# Altium schematic sheet JY02_2019.SchDoc
size A4
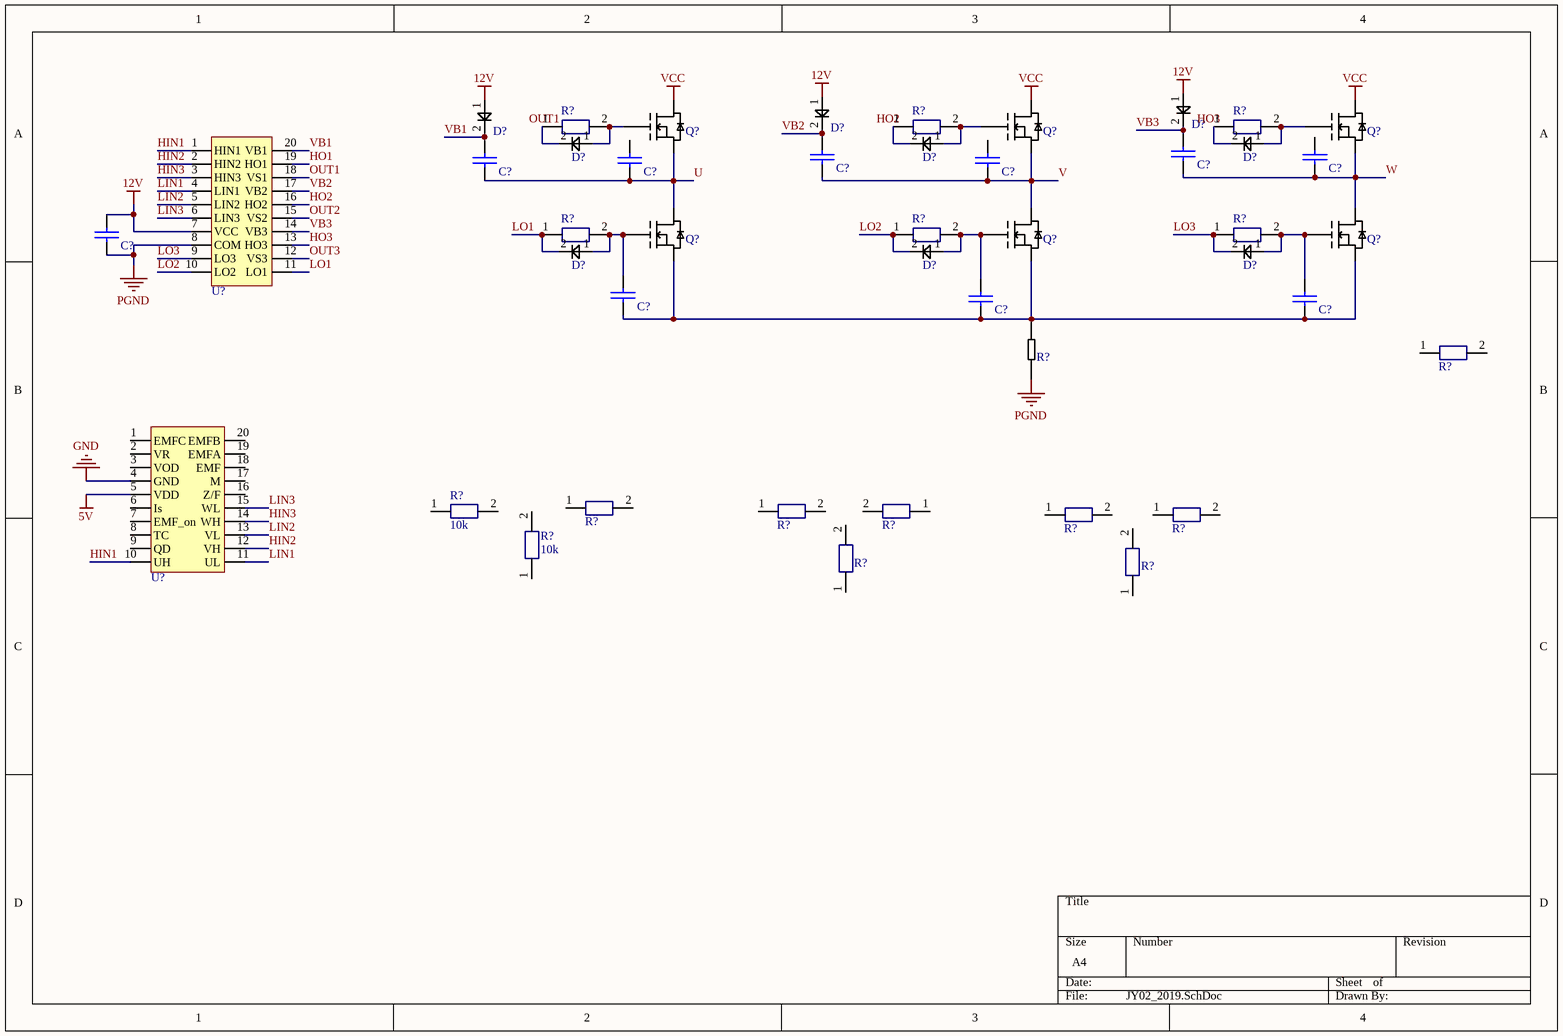
[diagram p0: JY02_2019.SchDoc]

## Parts
(Parts that share a designator on the sheet are numbered #1, #2 ... from top to bottom, then left to right.)
C?#1  0805c  [0805C]  (value not drawn)
C?#2  0805c  [0805C]  (value not drawn)
C?#3  0805c  [0805C]  (value not drawn)
C?#4  0805c  [0805C]  (value not drawn)
C?#5  0805c  [0805C]  (value not drawn)
C?#6  0805c  [0805C]  (value not drawn)
C?#7  0805c  [0805C]  (value not drawn)
C?#8  0805c  [0805C]  (value not drawn)
C?#9  0805c  [0805C]  (value not drawn)
C?#10  0805c  [0805C]  (value not drawn)
D?#1  0805D  [0805D]  (value not drawn)
D?#2  0805D  [0805D]  (value not drawn)
D?#3  0805D  [0805D]  (value not drawn)
D?#4  0805D  [0805D]  (value not drawn)
D?#5  0805D  [0805D]  (value not drawn)
D?#6  0805D  [0805D]  (value not drawn)
D?#7  0805D  [0805D]  (value not drawn)
D?#8  0805D  [0805D]  (value not drawn)
D?#9  0805D  [0805D]  (value not drawn)
Q?#1  NMOS  [TO263-2]  (value not drawn)
Q?#2  NMOS  [TO263-2]  (value not drawn)
Q?#3  NMOS  [TO263-2]  (value not drawn)
Q?#4  NMOS  [TO263-2]  (value not drawn)
Q?#5  NMOS  [TO263-2]  (value not drawn)
Q?#6  NMOS  [TO263-2]  (value not drawn)
R?#1  0805r  [0805R]  (value not drawn)
R?#2  0805r  [0805R]  (value not drawn)
R?#3  0805r  [0805R]  (value not drawn)
R?#4  0805r  [0805R]  (value not drawn)
R?#5  0805r  [0805R]  (value not drawn)
R?#6  0805r  [0805R]  (value not drawn)
R?#7  2512R  [2512R]  (value not drawn)
R?#8  0805r  [0805R]  (value not drawn)
R?#9  0805r  [0805R]  (value not drawn)
R?#10  0805r  [0805R]  (value not drawn)
R?#11  0805r  [0805R]  (value not drawn)
R?#12  0805r  [0805R]  (value not drawn)
R?#13  0805r  [0805R]  (value not drawn)
R?#14  0805r  [0805R]  (value not drawn)
R?#15  0805r  [0805R]  (value not drawn)
R?#16  0805r  [0805R]  (value not drawn)
R?#17  0805r  [0805R]  (value not drawn)
U?#1  FD6288  [TSSOP20-OR65-4R40]  (value not drawn)
U?#2  JY02  [SSOP20-25-150-1]  (value not drawn)

## Nets
5V: U?#2.5(VDD)
12V: C?#7.1 D?#1.1 D?#2.1 D?#3.1 U?#1.7(VCC)
GND: U?#2.4(GND)
PGND: C?#7.2 R?#7.1 U?#1.8(COM)
VCC: Q?#1.2(D) Q?#2.2(D) Q?#3.2(D)
HIN1: U?#1.1(HIN1) U?#2.10(UH)
HIN2: U?#1.2(HIN2) U?#2.12(VH)
HIN3: U?#1.3(HIN3) U?#2.14(WH)
HO1: U?#1.19(HO1)
HO2: U?#1.16(HO2)
HO3: U?#1.13(HO3)
LIN1: U?#1.4(LIN1) U?#2.11(UL)
LIN2: U?#1.5(LIN2) U?#2.13(VL)
LIN3: U?#1.6(LIN3) U?#2.15(WL)
LO1: D?#7.2 R?#4.1 U?#1.11(LO1)
LO2: D?#8.2 R?#5.1 U?#1.10(LO2)
LO3: D?#9.2 R?#6.1 U?#1.9(LO3)
OUT1: U?#1.18(VS1)
OUT2: U?#1.15(VS2)
OUT3: U?#1.12(VS3)
U: C?#2.2 C?#3.2 Q?#1.3(D) Q?#4.2(D)
V: C?#4.2 C?#5.2 Q?#2.3(D) Q?#5.2(D)
VB1: C?#2.1 D?#2.2 U?#1.20(VB1)
VB2: C?#4.1 D?#3.2 U?#1.17(VB2)
VB3: C?#1.1 D?#1.2 U?#1.14(VB3)
W: C?#1.2 C?#6.2 Q?#3.3(D) Q?#6.2(D)
NetC?#8_1: C?#8.1 D?#7.1 Q?#4.1(G) R?#4.2
NetC?#8_2: C?#8.2 C?#9.2 C?#10.2 Q?#4.3(D) Q?#5.3(D) Q?#6.3(D) R?#7.2
NetC?#9_1: C?#9.1 D?#8.1 Q?#5.1(G) R?#5.2
NetC?#10_1: C?#10.1 D?#9.1 Q?#6.1(G) R?#6.2
NetD?#4_1: D?#4.1 Q?#1.1(G) R?#1.2
NetD?#4_2: D?#4.2 R?#1.1
NetD?#5_1: D?#5.1 Q?#2.1(G) R?#2.2
NetD?#5_2: D?#5.2 R?#2.1
NetD?#6_1: D?#6.1 Q?#3.1(G) R?#3.2
NetD?#6_2: D?#6.2 R?#3.1

Not connected (* = marked no-connect by the designer): C?#3 1; C?#5 1; C?#6 1; R?#8 1 2; R?#9 1 2; R?#10 1 2; R?#11 1 2; R?#12 1 2; R?#13 1 2; R?#14 1 2; R?#15 1 2; R?#16 1 2; R?#17 1 2; U?#2 1(EMFC) 2(VR) 3(VOD) 6(Is) 7(EMF_on) 8(TC) 9(QD) 16(Z/F) 17(M) 18(EMF) 19(EMFA) 20(EMFB)

## Notes on the sheet
- Labels drawn without touching a wire or pin: HO2, HO3, OUT1
- (in symbol 0805r) 10k